# EAGLE schematic fc-comms (EAGLE 6.6.0)

## Sheet 1 of 2
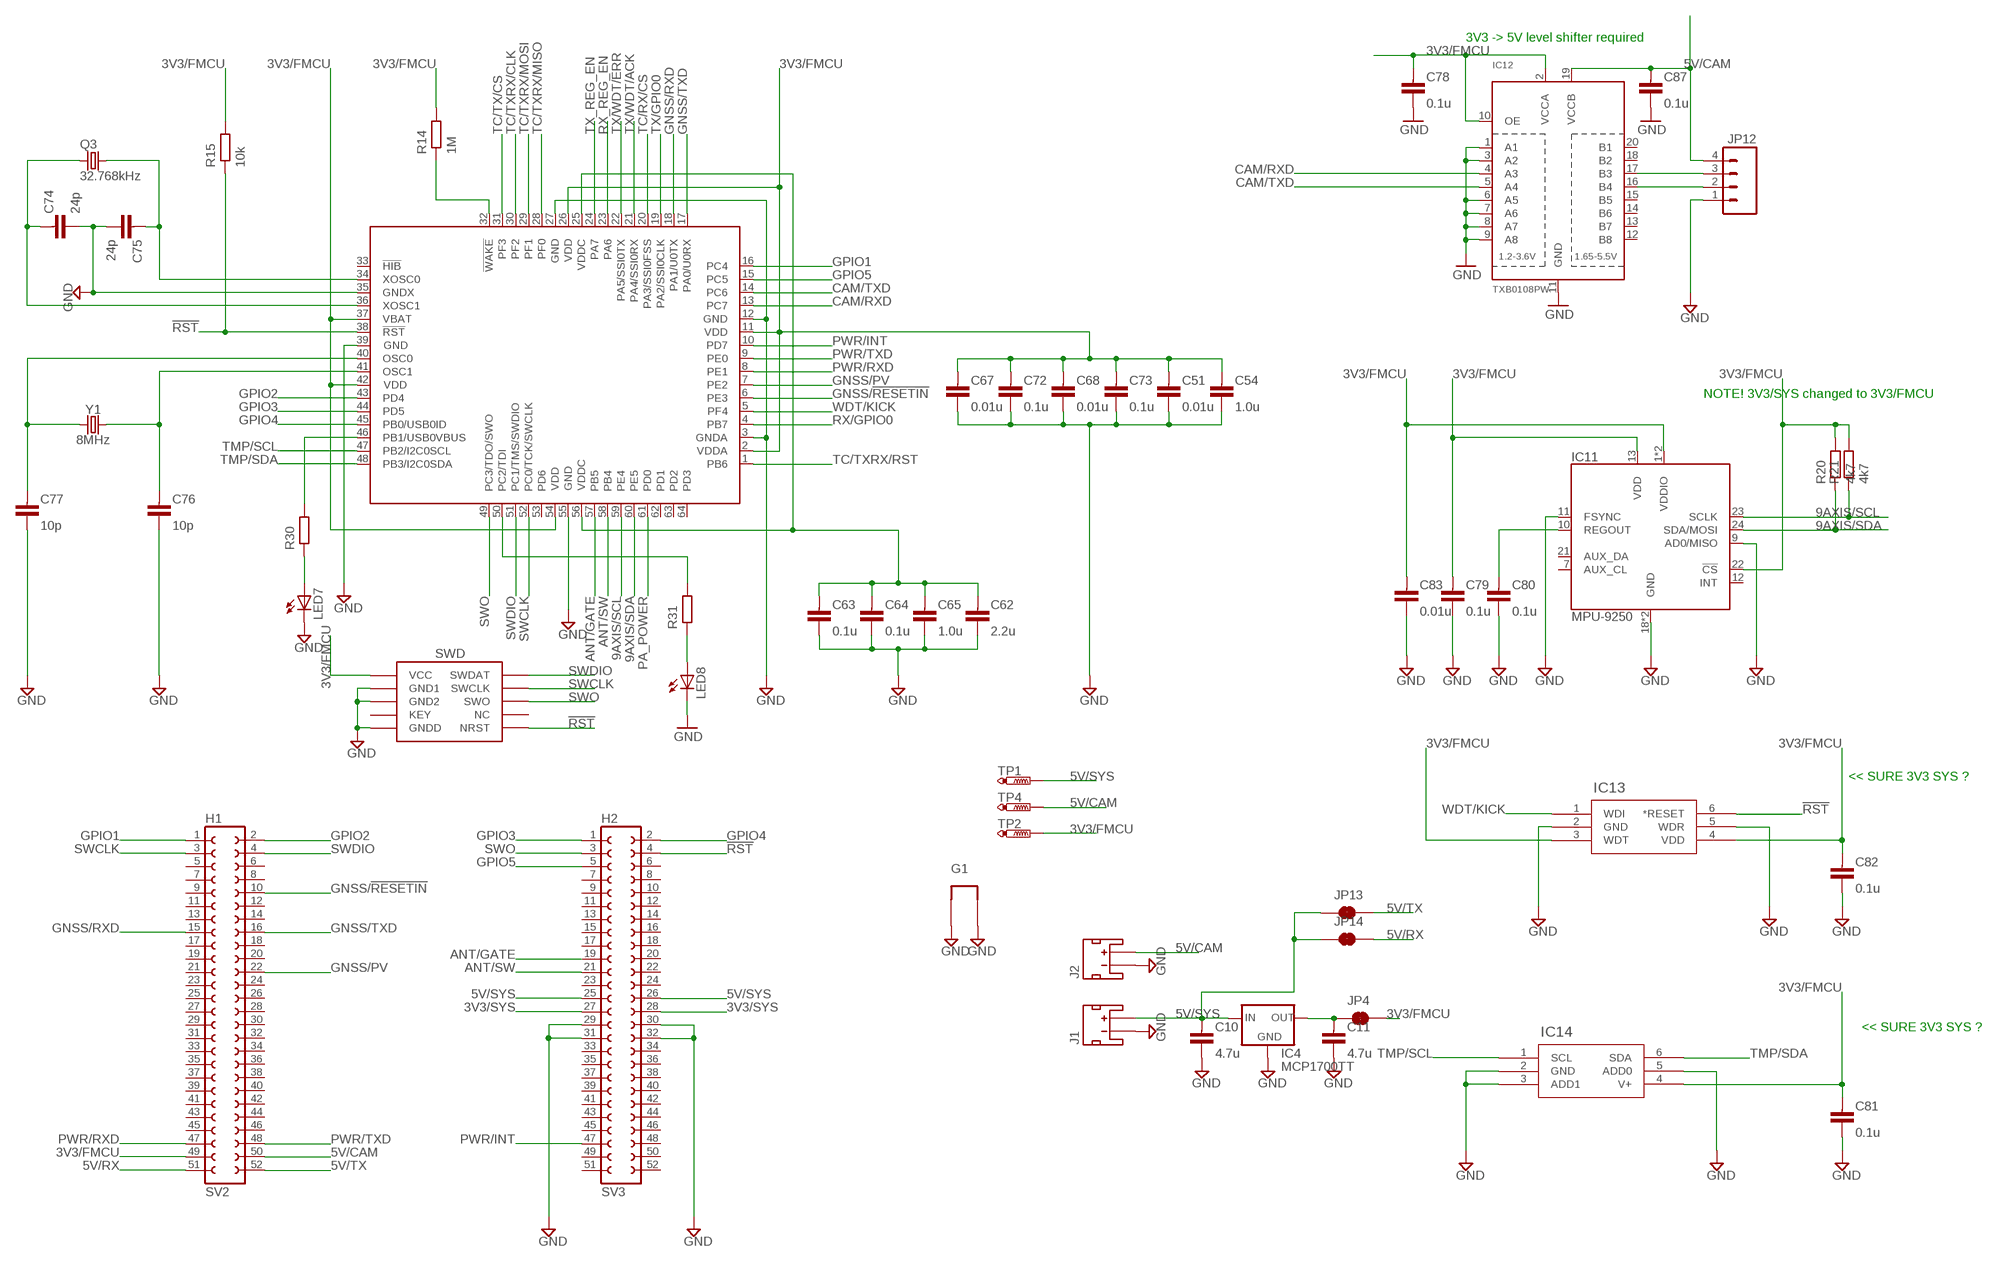
[diagram p0: schematic, sheet 1]

### Parts
C10  4.7u  CAPACITOR0603-N  [C0603-N]
C11  4.7u  CAPACITOR0603-N  [C0603-N]
C51  0.01u  CAPACITOR0603-N  [C0603-N]
C54  1.0u  CAPACITOR0603-N  [C0603-N]
C62  2.2u  CAPACITOR0603-N  [C0603-N]
C63  0.1u  CAPACITOR0603-N  [C0603-N]
C64  0.1u  CAPACITOR0603-N  [C0603-N]
C65  1.0u  CAPACITOR0603-N  [C0603-N]
C67  0.01u  CAPACITOR0603-N  [C0603-N]
C68  0.01u  CAPACITOR0603-N  [C0603-N]
C72  0.1u  CAPACITOR0603-N  [C0603-N]
C73  0.1u  CAPACITOR0603-N  [C0603-N]
C74  24p  CAPACITOR0603-N  [C0603-N]
C75  24p  CAPACITOR0603-N  [C0603-N]
C76  10p  CAPACITOR0603-N  [C0603-N]
C77  10p  CAPACITOR0603-N  [C0603-N]
C78  0.1u  CAPACITOR0603-N  [C0603-N]
C79  0.1u  CAPACITOR0603-N  [C0603-N]
C80  0.1u  CAPACITOR0603-N  [C0603-N]
C81  0.1u  CAPACITOR0603-N  [C0603-N]
C82  0.1u  CAPACITOR0603-N  [C0603-N]
C83  0.01u  CAPACITOR0603-N  [C0603-N]
C87  0.1u  CAPACITOR0603-N  [C0603-N]
G1  GND-LOOPL  [GND-LOOP-0.4]
IC4  MCP1700TT  [SOT23]
IC9  TM4C123[7,G]XXPM  [PM_S-PQFP-G64]
IC11  MPU-9250  [QFN-24/3MM]
IC12  TXB0108PW  [TSSOP20]
IC13  TPS3813K33-EP_DBV_6  [DBV6]
IC14  TMP100-EP_DBV_6  [DBV6]
J1  JST_2MM_MALE_TH  [JST-2-TH]
J2  JST_2MM_MALE_TH  [JST-2-TH]
J3  SWD_SHROUD  [SWD_PTH_SHROUD]
JP4  JUMPER-SMT_2_NC_TRACE_SILK  [SMT-JUMPER_2_NC_TRACE_SILK]
JP12  M04PTH  [1X04]
JP13  JUMPER-SMT_2_NC_TRACE_SILK  [SMT-JUMPER_2_NC_TRACE_SILK]
JP14  JUMPER-SMT_2_NC_TRACE_SILK  [SMT-JUMPER_2_NC_TRACE_SILK]
LED7  LEDCHIP-LED0603  [CHIP-LED0603]
LED8  LEDCHIP-LED0603  [CHIP-LED0603]
Q3  32.768kHz  RESONATOR_EPSON_FC_145  [RESONATOR_EPSON_FC_145]
R14  1M  RESISTOR0603-N  [R0603-N]
R15  10k  RESISTOR0603-N  [R0603-N]
R20  4k7  RESISTOR0603-N  [R0603-N]
R21  4k7  RESISTOR0603-N  [R0603-N]
R30  RESISTOR0603-N  [R0603-N]
R31  RESISTOR0603-N  [R0603-N]
SV2  H1  FE26-2  [FE26-2]
SV3  H2  FE26-2  [FE26-2]
TP1  PTR1PAD1-13  [P1-13]
TP2  PTR1PAD1-13  [P1-13]
TP4  PTR1PAD1-13  [P1-13]
Y1  8MHz  CRYSTAL-8MHZSMD-5X3.2  [CRYSTAL-SMD-5X3.2-4PAD]

### Nets
3V3/FMCU: C51.1 C54.1 C67.1 C68.1 C72.1 C73.1 C78.1 C79.1 C81.1 C82.1 C83.1 IC9.2(VDDA) IC9.11(VDD) IC9.26(VDD) IC9.37(VBAT) IC9.42(VDD) IC9.54(VDD) IC11.1(VDDIO) IC11.8(VDDIO) IC11.13(VDD) IC11.22(!CS) IC12.2(VCCA) IC12.10(OE) IC13.3(WDT) IC13.4(VDD) IC14.4(V+) J3.1(VCC) JP4.2 R14.2 R15.2 R20.2 R21.2 SV2.49 TP2.TP ; also sheet 2
3V3/SYS: SV3.27 SV3.28
5V/CAM: C87.1 IC12.19(VCCB) J2.1(+) JP12.4 SV2.50 TP4.TP
5V/RX: JP14.2 SV2.51 ; also sheet 2
5V/SYS: C10.1 IC4.3(IN) J1.1(+) JP13.1 JP14.1 SV3.25 SV3.26 TP1.TP
5V/TX: JP13.2 SV2.52 ; also sheet 2
9AXIS/SCL: IC9.59(PE4) IC11.23(SCLK) R21.1
9AXIS/SDA: IC9.60(PE5) IC11.24(SDA/MOSI) R20.1
!RST: IC9.38(!RST) IC13.6(*RESET) J3.10(NRST) R15.1 SV3.4
!WAKE: IC9.32(!WAKE) R14.1
ANT/GATE: IC9.57(PB5) SV3.19
ANT/SW: IC9.58(PB4) SV3.21
CAM/RXD: IC9.13(PC7) IC12.4(A3)
CAM/TXD: IC9.14(PC6) IC12.5(A4)
GND: C10.2 C11.2 C51.2 C54.2 C62.2 C63.2 C64.2 C65.2 C67.2 C68.2 C72.2 C73.2 C74.2 C75.2 C76.2 C77.2 C78.2 C79.2 C80.2 C81.2 C82.2 C83.2 C87.2 G1.P$3 G1.P$4 IC4.1(GND) IC9.3(GNDA) IC9.12(GND) IC9.27(GND) IC9.35(GNDX) IC9.39(GND) IC9.55(GND) IC11.9(AD0/MISO) IC11.11(FSYNC) IC11.18(GND) IC11.20(GND) IC12.1(A1) IC12.3(A2) IC12.6(A5) IC12.7(A6) IC12.8(A7) IC12.9(A8) IC12.11(GND) IC13.2(GND) IC13.5(WDR) IC14.2(GND) IC14.3(ADD1) IC14.5(ADD0) J1.2(-) J2.2(-) J3.3(GND1) J3.5(GND2) J3.9(GNDD) JP12.1 LED7.C LED8.C SV3.29 SV3.30 SV3.31 SV3.32 ; also sheet 2
GNSS/!RESETIN: IC9.6(PE3) SV2.10
GNSS/PV: IC9.7(PE2) SV2.22
GNSS/RXD: IC9.18(PA1/U0TX) SV2.15
GNSS/TXD: IC9.17(PA0/U0RX) SV2.16
GPIO1: IC9.16(PC4) SV2.1
GPIO2: IC9.43(PD4) SV2.2
GPIO3: IC9.44(PD5) SV3.1
GPIO4: IC9.45(PB0/USB0ID) SV3.2
GPIO5: IC9.15(PC5) SV3.5
N$4: C80.1 IC11.10(REGOUT)
N$5: C62.1 C63.1 C64.1 C65.1 IC9.25(VDDC) IC9.56(VDDC)
N$6: C75.1 IC9.34(XOSC0) Q3.P$2
N$8: C77.1 IC9.40(OSC0) Y1.1
N$33: C76.1 IC9.41(OSC1) Y1.3
N$34: C74.1 IC9.36(XOSC1) Q3.P$1
N$43: LED7.A R30.1
N$44: LED8.A R31.1
N$49: IC9.50(PC2/TDI) R31.2
N$51: IC9.46(PB1/USB0VBUS) R30.2
N$61: IC12.17(B3) JP12.3
N$64: C11.1 IC4.2(OUT) JP4.1
N$73: IC12.16(B4) JP12.2
PA_POWER: IC9.61(PD0) ; also sheet 2
PWR/INT: IC9.10(PD7) SV3.47
PWR/RXD: IC9.8(PE1) SV2.47
PWR/TXD: IC9.9(PE0) SV2.48
RX/GPIO0: IC9.4(PB7) ; also sheet 2
RX_REG_EN: IC9.23(PA6) ; also sheet 2
SWCLK: IC9.52(PC0/TCK/SWCLK) J3.4(SWCLK) SV2.3
SWDIO: IC9.51(PC1/TMS/SWDIO) J3.2(SWDAT) SV2.4
SWO: IC9.49(PC3/TDO/SWO) J3.6(SWO) SV3.3
TC/RX/CS: IC9.20(PA3/SSI0FSS) ; also sheet 2
TC/TX/CS: IC9.31(PF3) ; also sheet 2
TC/TXRX/CLK: IC9.30(PF2) ; also sheet 2
TC/TXRX/MISO: IC9.28(PF0) ; also sheet 2
TC/TXRX/MOSI: IC9.29(PF1) ; also sheet 2
TC/TXRX/RST: IC9.1(PB6) ; also sheet 2
TMP/SCL: IC9.47(PB2/I2C0SCL) IC14.1(SCL) ; also sheet 2
TMP/SDA: IC9.48(PB3/I2C0SDA) IC14.6(SDA) ; also sheet 2
TX/GPIO0: IC9.19(PA2/SSI0CLK) ; also sheet 2
TX/WDT/ACK: IC9.21(PA4/SSI0RX) ; also sheet 2
TX/WDT/ERR: IC9.22(PA5/SSI0TX) ; also sheet 2
TX_REG_EN: IC9.24(PA7) ; also sheet 2
WDT/KICK: IC9.5(PF4) IC13.1(WDI)
Unconnected: IC9.33(!HIB) IC9.53(PD6) IC9.62(PD1) IC9.63(PD2) IC9.64(PD3) IC11.7(AUX_CL) IC11.12(INT) IC11.21(AUX_DA) IC12.12(B8) IC12.13(B7) IC12.14(B6) IC12.15(B5) IC12.18(B2) IC12.20(B1) J3.7(KEY) J3.8(NC) SV2.5 SV2.6 SV2.7 SV2.8 SV2.9 SV2.11 SV2.12 SV2.13 SV2.14 SV2.17 SV2.18 SV2.19 SV2.20 SV2.21 SV2.23 SV2.24 SV2.25 SV2.26 SV2.27 SV2.28 SV2.29 SV2.30 SV2.31 SV2.32 SV2.33 SV2.34 SV2.35 SV2.36 SV2.37 SV2.38 SV2.39 SV2.40 SV2.41 SV2.42 SV2.43 SV2.44 SV2.45 SV2.46 SV3.6 SV3.7 SV3.8 SV3.9 SV3.10 SV3.11 SV3.12 SV3.13 SV3.14 SV3.15 SV3.16 SV3.17 SV3.18 SV3.20 SV3.22 SV3.23 SV3.24 SV3.33 SV3.34 SV3.35 SV3.36 SV3.37 SV3.38 SV3.39 SV3.40 SV3.41 SV3.42 SV3.43 SV3.44 SV3.45 SV3.46 SV3.48 SV3.49 SV3.50 SV3.51 SV3.52

### Notes on the sheet
- 3V3 -> 5V level shifter required
- NOTE! 3V3/SYS changed to 3V3/FMCU
- << SURE 3V3 SYS ?
- << SURE 3V3 SYS ?

## Sheet 2 of 2
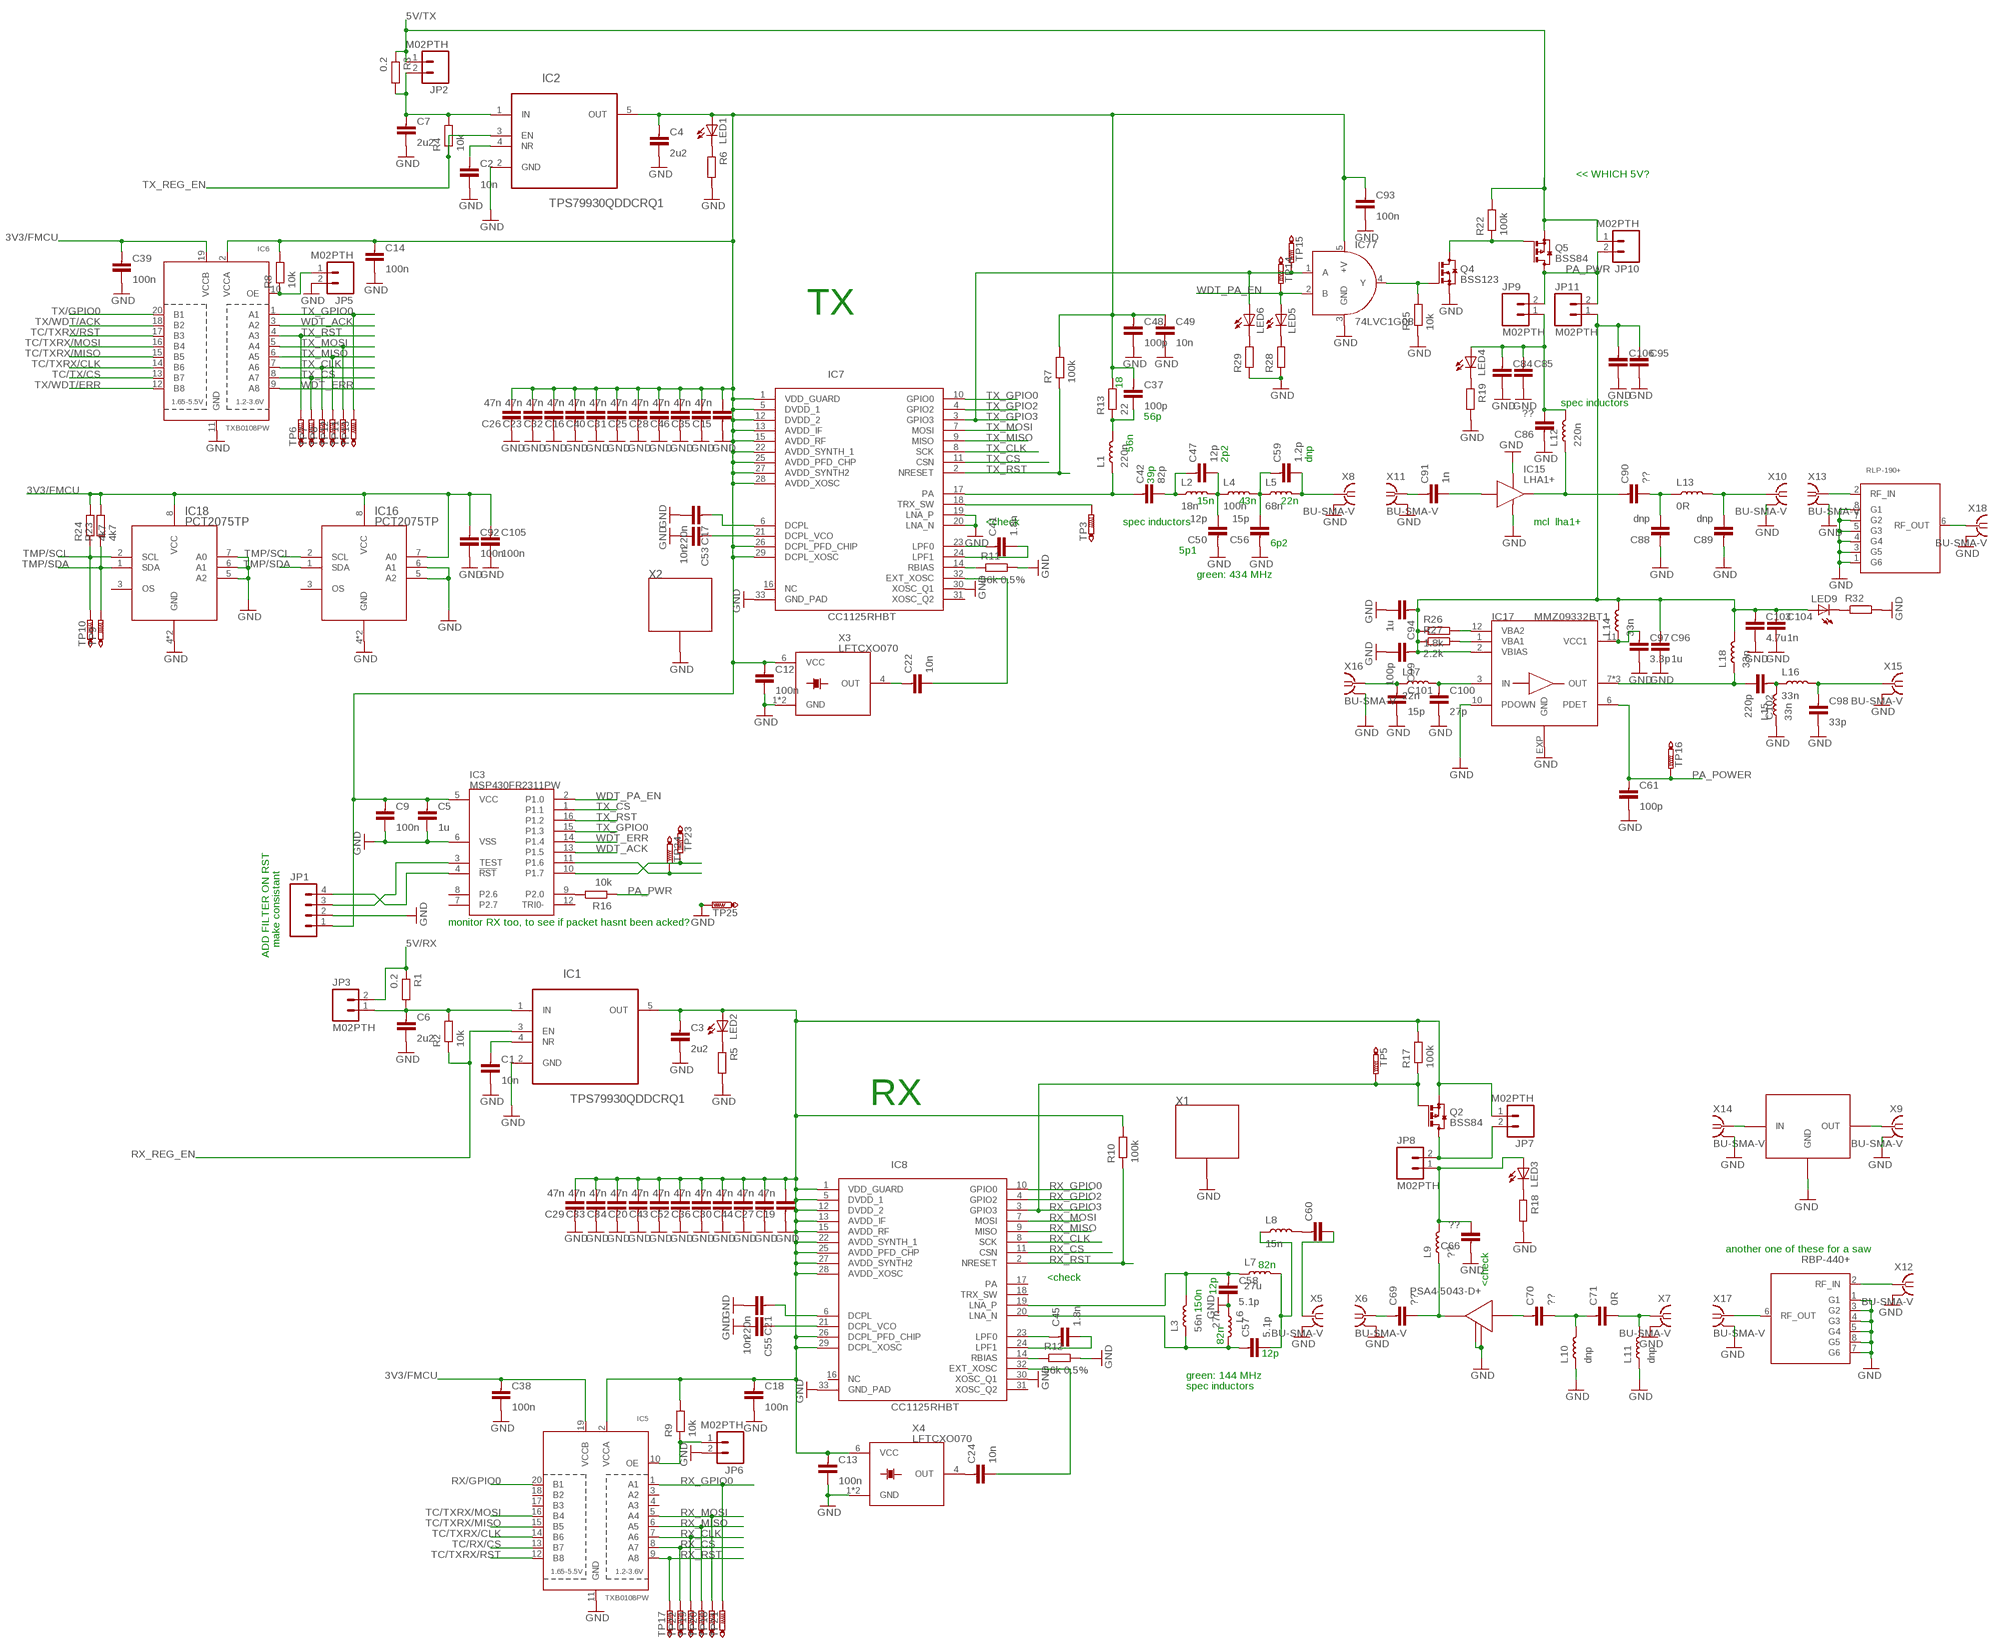
[diagram p1: schematic, sheet 2]

### Parts
C1  10n  CAPACITOR0603-N  [C0603-N]
C2  10n  CAPACITOR0603-N  [C0603-N]
C3  2u2  CAPACITOR0603-N  [C0603-N]
C4  2u2  CAPACITOR0603-N  [C0603-N]
C5  1u  CAPACITOR0603-N  [C0603-N]
C6  2u2  CAPACITOR0603-N  [C0603-N]
C7  2u2  CAPACITOR0603-N  [C0603-N]
C9  100n  CAPACITOR0603-N  [C0603-N]
C12  100n  CAPACITOR0603-N  [C0603-N]
C13  100n  CAPACITOR0603-N  [C0603-N]
C14  100n  CAPACITOR0603-N  [C0603-N]
C15  47n  CAPACITOR0603-N  [C0603-N]
C16  47n  CAPACITOR0603-N  [C0603-N]
C17  220n  CAPACITOR0603-N  [C0603-N]
C18  100n  CAPACITOR0603-N  [C0603-N]
C19  47n  CAPACITOR0603-N  [C0603-N]
C20  47n  CAPACITOR0603-N  [C0603-N]
C21  220n  CAPACITOR0603-N  [C0603-N]
C22  10n  CAPACITOR0603-N  [C0603-N]
C23  47n  CAPACITOR0603-N  [C0603-N]
C24  10n  CAPACITOR0603-N  [C0603-N]
C25  47n  CAPACITOR0603-N  [C0603-N]
C26  47n  CAPACITOR0603-N  [C0603-N]
C27  47n  CAPACITOR0603-N  [C0603-N]
C28  47n  CAPACITOR0603-N  [C0603-N]
C29  47n  CAPACITOR0603-N  [C0603-N]
C30  47n  CAPACITOR0603-N  [C0603-N]
C31  47n  CAPACITOR0603-N  [C0603-N]
C32  47n  CAPACITOR0603-N  [C0603-N]
C33  47n  CAPACITOR0603-N  [C0603-N]
C34  47n  CAPACITOR0603-N  [C0603-N]
C35  47n  CAPACITOR0603-N  [C0603-N]
C36  47n  CAPACITOR0603-N  [C0603-N]
C37  100p  CAPACITOR0603-N  [C0603-N]
C38  100n  CAPACITOR0603-N  [C0603-N]
C39  100n  CAPACITOR0603-N  [C0603-N]
C40  47n  CAPACITOR0603-N  [C0603-N]
C41  1.8n  CAPACITOR0603-N  [C0603-N]
C42  82p  CAPACITOR0603-N  [C0603-N]
C43  47n  CAPACITOR0603-N  [C0603-N]
C44  47n  CAPACITOR0603-N  [C0603-N]
C45  1.8n  CAPACITOR0603-N  [C0603-N]
C46  47n  CAPACITOR0603-N  [C0603-N]
C47  12p  CAPACITOR0603-N  [C0603-N]
C48  100p  CAPACITOR0603-N  [C0603-N]
C49  10n  CAPACITOR0603-N  [C0603-N]
C50  12p  CAPACITOR0603-N  [C0603-N]
C52  47n  CAPACITOR0603-N  [C0603-N]
C53  10n  CAPACITOR0603-N  [C0603-N]
C55  10n  CAPACITOR0603-N  [C0603-N]
C56  15p  CAPACITOR0603-N  [C0603-N]
C57  5.1p  CAPACITOR0603-N  [C0603-N]
C58  5.1p  CAPACITOR0603-N  [C0603-N]
C59  1.2p  CAPACITOR0603-N  [C0603-N]
C60  CAPACITOR0603-N  [C0603-N]
C61  100p  CAPACITOR0603-N  [C0603-N]
C66  ??  CAPACITOR0603-N  [C0603-N]
C69  ??  CAPACITOR0603-N  [C0603-N]
C70  ??  CAPACITOR0603-N  [C0603-N]
C71  0R  CAPACITOR0603-N  [C0603-N]
C84  CAPACITOR0805-N  [C0805-N]
C85  CAPACITOR0805-N  [C0805-N]
C86  ??  CAPACITOR0603-N  [C0603-N]
C88  dnp  CAPACITOR0603-N  [C0603-N]
C89  dnp  CAPACITOR0603-N  [C0603-N]
C90  ??  CAPACITOR0603-N  [C0603-N]
C91  1n  CAPACITOR0603-N  [C0603-N]
C92  100n  CAPACITOR0603-N  [C0603-N]
C93  100n  CAPACITOR0603-N  [C0603-N]
C94  1u  CAPACITOR0603-N  [C0603-N]
C95  CAPACITOR0805-N  [C0805-N]
C96  1u  CAPACITOR0603-N  [C0603-N]
C97  3.3p  CAPACITOR0603-N  [C0603-N]
C98  33p  CAPACITOR0603-N  [C0603-N]
C99  100p  CAPACITOR0603-N  [C0603-N]
C100  27p  CAPACITOR0603-N  [C0603-N]
C101  15p  CAPACITOR0603-N  [C0603-N]
C102  220p  CAPACITOR0603-N  [C0603-N]
C103  4.7u  CAPACITOR0603-N  [C0603-N]
C104  1n  CAPACITOR0603-N  [C0603-N]
C105  100n  CAPACITOR0603-N  [C0603-N]
C106  CAPACITOR0805-N  [C0805-N]
FL1  GOLLEDGE_SAW_FILTER  [GOLLEDGE_SAW]
FL2  SAW_FILTER_CS  [PL-176]
FL3  LPF_CS  [PL-176]
IC1  TPS79930QDDCRQ1  TPS79933QDDCRQ1  [SOT95P280X110-5N]
IC2  TPS79930QDDCRQ1  TPS79933QDDCRQ1  [SOT95P280X110-5N]
IC3  MSP430FR2311PW  [SSOP16]
IC5  TXB0108PW  [TSSOP20]
IC6  TXB0108PW  [TSSOP20]
IC7  CC1125RHBT  [QFN32_5X5]
IC8  CC1125RHBT  [QFN32_5X5]
IC10  LNA_COMMON  [LNA_MMM1362]
IC15  LHA1+  PA  [PA]
IC16  PCT2075TP  [HWSON8]
IC17  MMZ09332BT1  [QFN3X3-6]
IC18  PCT2075TP  [HWSON8]
IC77  74LVC1G08  SN74LVC1G08  [SOT23-5]
JP1  M04PTH  [1X04]
JP2  M02PTH  [1X02]
JP3  M02PTH  [1X02]
JP5  M02PTH  [1X02]
JP6  M02PTH  [1X02]
JP7  M02PTH  [1X02]
JP8  M02PTH  [1X02]
JP9  M02PTH  [1X02]
JP10  M02PTH  [1X02]
JP11  M02PTH  [1X02]
L1  220n  INDUCTOR0603-N  [L0603-N]
L2  18n  INDUCTOR0603-N  [L0603-N]
L3  56n  INDUCTOR0603-N  [L0603-N]
L4  100n  INDUCTOR0603-N  [L0603-N]
L5  68n  INDUCTOR0603-N  [L0603-N]
L6  27n  INDUCTOR0603-N  [L0603-N]
L7  27u  INDUCTOR0603-N  [L0603-N]
L8  15n  INDUCTOR0603-N  [L0603-N]
L9  ??  INDUCTOR0603-N  [L0603-N]
L10  dnp  INDUCTOR0603-N  [L0603-N]
L11  dnp  INDUCTOR0603-N  [L0603-N]
L12  220n  INDUCTOR0603-N  [L0603-N]
L13  0R  INDUCTOR0603-N  [L0603-N]
L14  33n  INDUCTOR0603-N  [L0603-N]
L15  33n  INDUCTOR0603-N  [L0603-N]
L16  33n  INDUCTOR0603-N  [L0603-N]
L17  22n  INDUCTOR0603-N  [L0603-N]
L18  33n  INDUCTOR0603-N  [L0603-N]
LED1  LEDCHIP-LED0603  [CHIP-LED0603]
LED2  LEDCHIP-LED0603  [CHIP-LED0603]
LED3  LEDCHIP-LED0603  [CHIP-LED0603]
LED4  LEDCHIP-LED0603  [CHIP-LED0603]
LED5  LEDCHIP-LED0603  [CHIP-LED0603]
LED6  LEDCHIP-LED0603  [CHIP-LED0603]
LED9  LEDCHIP-LED0603  [CHIP-LED0603]
Q2  BSS84  [SOT23]
Q4  BSS123  [SOT23]
Q5  BSS84  [SOT23]
R1  0.2  RESISTOR0603-N  [R0603-N]
R2  10k  RESISTOR0603-N  [R0603-N]
R3  0.2  RESISTOR0603-N  [R0603-N]
R4  10k  RESISTOR0603-N  [R0603-N]
R5  RESISTOR0603-N  [R0603-N]
R6  RESISTOR0603-N  [R0603-N]
R7  100k  RESISTOR0603-N  [R0603-N]
R8  10k  RESISTOR0603-N  [R0603-N]
R9  10k  RESISTOR0603-N  [R0603-N]
R10  100k  RESISTOR0603-N  [R0603-N]
R11  56k 0.5%  RESISTOR0603-N  [R0603-N]
R12  56k 0.5%  RESISTOR0603-N  [R0603-N]
R13  22  RESISTOR0603-N  [R0603-N]
R16  10k  RESISTOR0603-N  [R0603-N]
R17  100k  RESISTOR0603-N  [R0603-N]
R18  RESISTOR0603-N  [R0603-N]
R19  RESISTOR0603-N  [R0603-N]
R22  100k  RESISTOR0603-N  [R0603-N]
R23  4k7  RESISTOR0603-N  [R0603-N]
R24  4k7  RESISTOR0603-N  [R0603-N]
R25  10k  RESISTOR0603-N  [R0603-N]
R26  1.8k  RESISTOR0603-N  [R0603-N]
R27  2.2k  RESISTOR0603-N  [R0603-N]
R28  RESISTOR0603-N  [R0603-N]
R29  RESISTOR0603-N  [R0603-N]
R32  RESISTOR0603-N  [R0603-N]
TP3  PTR1B1,27  [B1,27]
TP5  PTR1B1,27  [B1,27]
TP6  PTR1B1,27  [B1,27]
TP7  PTR1B1,27  [B1,27]
TP8  PTR1B1,27  [B1,27]
TP9  PTR1B1,27  [B1,27]
TP10  PTR1B1,27  [B1,27]
TP11  PTR1B1,27  [B1,27]
TP12  PTR1B1,27  [B1,27]
TP13  PTR1B1,27  [B1,27]
TP14  PTR1B1,27  [B1,27]
TP15  PTR1B1,27  [B1,27]
TP16  PTR1B1,27  [B1,27]
TP17  PTR1B1,27  [B1,27]
TP18  PTR1B1,27  [B1,27]
TP19  PTR1B1,27  [B1,27]
TP20  PTR1B1,27  [B1,27]
TP21  PTR1B1,27  [B1,27]
TP22  PTR1B1,27  [B1,27]
TP23  PTR1B1,27  [B1,27]
TP24  PTR1B1,27  [B1,27]
TP25  PTR1B1,27  [B1,27]
X1  SHIELD-26X26  [SHIELD-26X26]
X2  SHIELD-26X26  [SHIELD-26X26]
X3  LFTCXO070  [260-SERIES]
X4  LFTCXO070  [260-SERIES]
X5  BU-SMA-V  [BU-SMA-V]
X6  BU-SMA-V  [BU-SMA-V]
X7  BU-SMA-V  [BU-SMA-V]
X8  BU-SMA-V  [BU-SMA-V]
X9  BU-SMA-V  [BU-SMA-V]
X10  BU-SMA-V  [BU-SMA-V]
X11  BU-SMA-V  [BU-SMA-V]
X12  BU-SMA-V  [BU-SMA-V]
X13  BU-SMA-V  [BU-SMA-V]
X14  BU-SMA-V  [BU-SMA-V]
X15  BU-SMA-V  [BU-SMA-V]
X16  BU-SMA-V  [BU-SMA-V]
X17  BU-SMA-V  [BU-SMA-V]
X18  BU-SMA-V  [BU-SMA-V]

### Nets
3V3/FMCU: C38.1 C39.1 C92.1 C105.1 IC5.19(VCCB) IC6.19(VCCB) IC16.7(A0) IC16.8(VCC) IC18.8(VCC) R23.2 R24.2 ; also sheet 1
5V/RX: JP3.2 R1.1 ; also sheet 1
5V/TX: JP2.1 JP10.1 Q5.2(S) R3.1 R22.2 ; also sheet 1
EWFEWF: C6.1 IC1.1(IN) JP3.1 R1.2 R2.2
GND: C1.2 C2.2 C3.2 C4.2 C5.2 C6.2 C7.2 C9.2 C12.2 C13.2 C14.2 C15.1 C16.1 C17.2 C18.2 C19.1 C20.1 C21.2 C23.1 C25.1 C26.1 C27.1 C28.1 C29.1 C30.1 C31.1 C32.1 C33.1 C34.1 C35.1 C36.1 C38.2 C39.2 C40.1 C43.1 C44.1 C46.1 C48.2 C49.2 C50.1 C52.1 C53.2 C55.2 C56.1 C58.2 C61.2 C66.1 C84.2 C85.2 C86.1 C88.1 C89.1 C92.2 C93.2 C94.2 C95.2 C96.2 C97.2 C98.2 C99.2 C100.2 C101.2 C103.2 C104.2 C105.2 C106.2 FL1.A(GND) FL1.C(GND) FL1.D(GND) FL1.F(GND) FL2.1(G1) FL2.3(G2) FL2.4(G3) FL2.5(G4) FL2.7(G6) FL2.8(G5) FL3.1(G6) FL3.3(G5) FL3.4(G4) FL3.5(G3) FL3.7(G2) FL3.8(G1) IC1.2(GND) IC2.2(GND) IC3.6(VSS) IC5.11(GND) IC6.11(GND) IC7.19(LNA_P) IC7.20(LNA_N) IC7.30(XOSC_Q1) IC7.33(GND_PAD) IC8.30(XOSC_Q1) IC8.33(GND_PAD) IC10.2 IC10.4 IC15.GND1 IC15.GND2 IC16.4(GND) IC16.5(A2) IC16.6(A1) IC16.EP(GND) IC17.10(PDOWN) IC17.EXP(GND) IC18.4(GND) IC18.5(A2) IC18.6(A1) IC18.7(A0) IC18.EP(GND) IC77.3(GND) JP1.2 JP5.2 JP6.2 L6.1 L10.1 L11.1 L15.1 Q4.2(S) R5.2 R6.2 R11.2 R12.2 R18.2 R19.2 R25.1 R28.1 R29.1 R32.2 TP25.TP X1.G1(G) X1.G2(G) X1.G3(G) X1.G4(G) X1.G5(G) X1.G6(G) X1.G7(G) X1.G8(G) X1.G9(G) X1.G10(G) X1.G11(G) X1.G12(G) X1.G13(G) X1.G14(G) X1.G15(G) X1.G16(G) X1.G17(G) X1.G19(G) X1.G20(G) X1.G21(G) X2.G1(G) X2.G2(G) X2.G3(G) X2.G4(G) X2.G5(G) X2.G6(G) X2.G7(G) X2.G8(G) X2.G9(G) X2.G10(G) X2.G11(G) X2.G12(G) X2.G13(G) X2.G14(G) X2.G15(G) X2.G16(G) X2.G17(G) X2.G19(G) X2.G20(G) X2.G21(G) X3.1(GND) X3.3(GND) X4.1(GND) X4.3(GND) X5.2 X5.3 X5.4 X5.5 X6.2 X6.3 X6.4 X6.5 X7.2 X7.3 X7.4 X7.5 X8.2 X8.3 X8.4 X8.5 X9.2 X9.3 X9.4 X9.5 X10.2 X10.3 X10.4 X10.5 X11.2 X11.3 X11.4 X11.5 X12.2 X12.3 X12.4 X12.5 X13.2 X13.3 X13.4 X13.5 X14.2 X14.3 X14.4 X14.5 X15.2 X15.3 X15.4 X15.5 X16.2 X16.3 X16.4 X16.5 X17.2 X17.3 X17.4 X17.5 X18.2 X18.3 X18.4 X18.5 ; also sheet 1
N$1: IC3.9(P2.0) R16.2
N$2: C66.2 JP8.1 L9.2 LED3.A
N$7: C41.1 IC7.23(LPF0)
N$9: C41.2 IC7.24(LPF1)
N$11: C53.1 IC7.21(DCPL_VCO)
N$12: C42.1 IC7.17(PA) L1.1
N$13: IC7.14(RBIAS) R11.1
N$14: C22.2 IC7.32(EXT_XOSC)
N$15: C37.2 L1.2 R13.1
N$16: C91.2 IC15.RF_IN
N$17: C69.1 X6.1
N$18: C90.1 IC15.RF_OUT L12.1
N$19: C17.1 IC7.6(DCPL)
N$20: C42.2 C47.1 L2.1
N$21: C47.2 C50.2 L2.2 L4.1
N$22: C56.2 C59.1 L4.2 L5.1
N$23: C59.2 L5.2 X8.1
N$24: C94.1 C95.1 C96.1 C99.1 C103.1 C104.1 C106.1 IC17.2(VBIAS) JP11.1 L14.2 L18.2 LED9.A R26.1 R27.1
N$25: C69.2 IC10.1(RF_OUT) L9.1
N$26: C91.1 X11.1
N$27: C88.2 C90.2 L13.1
N$28: FL3.2(RF_IN) X13.1
N$29: FL3.6(RF_OUT) X18.1
N$30: C45.1 IC8.23(LPF0)
N$31: C45.2 IC8.24(LPF1)
N$32: C55.1 IC8.21(DCPL_VCO)
N$35: IC8.14(RBIAS) R12.1
N$36: C24.2 IC8.32(EXT_XOSC)
N$37: C89.2 L13.2 X10.1
N$38: LED5.C R28.2
N$39: IC7.18(TRX_SW) TP3.TP
N$40: C4.1 C5.1 C9.1 C12.1 C14.1 C15.2 C16.2 C23.2 C25.2 C26.2 C28.2 C31.2 C32.2 C35.2 C37.1 C40.2 C46.2 C48.1 C49.1 C93.1 IC2.5(OUT) IC3.5(VCC) IC6.2(VCCA) IC7.1(VDD_GUARD) IC7.5(DVDD_1) IC7.12(DVDD_2) IC7.13(AVDD_IF) IC7.15(AVDD_RF) IC7.22(AVDD_SYNTH_1) IC7.25(AVDD_PFD_CHP) IC7.26(DCPL_PFD_CHIP) IC7.27(AVDD_SYNTH2) IC7.28(AVDD_XOSC) IC7.29(DCPL_XOSC) IC77.5(+V) JP1.1 LED1.A R7.2 R8.2 R13.2 X3.6(VCC)
N$41: LED6.C R29.2
N$45: C21.1 IC8.6(DCPL)
N$46: C70.1 IC10.3(RF_IN)
N$47: C58.1 IC8.19(LNA_P) L3.2 L7.1
N$48: C57.1 IC8.20(LNA_N) L3.1 L6.2
N$50: C70.2 C71.1 L10.2
N$52: JP7.2 JP8.2 Q2.3(D)
N$53: C3.1 C13.1 C18.1 C19.2 C20.2 C27.2 C29.2 C30.2 C33.2 C34.2 C36.2 C43.2 C44.2 C52.2 IC1.5(OUT) IC5.2(VCCA) IC8.1(VDD_GUARD) IC8.5(DVDD_1) IC8.12(DVDD_2) IC8.13(AVDD_IF) IC8.15(AVDD_RF) IC8.22(AVDD_SYNTH_1) IC8.25(AVDD_PFD_CHP) IC8.26(DCPL_PFD_CHIP) IC8.27(AVDD_SYNTH2) IC8.28(AVDD_XOSC) IC8.29(DCPL_XOSC) JP7.1 LED2.A Q2.2(S) R9.2 R10.2 R17.2 X4.6(VCC)
N$54: C71.2 L11.2 X7.1
N$55: FL2.2(RF_IN) X12.1
N$56: FL2.6(RF_OUT) X17.1
N$57: C2.1 IC2.4(NR)
N$60: C1.1 IC1.4(NR)
N$62: Q4.3(D) Q5.1(G) R22.1
N$66: LED1.C R6.1
N$67: LED2.C R5.1
N$68: FL1.E(OUT) X9.1
N$69: FL1.B(IN) X14.1
N$70: C102.1 L15.2 L16.1
N$71: C102.2 IC17.7(OUT) IC17.8(OUT) IC17.9(OUT) L18.1
N$72: C98.1 L16.2 X15.1
N$74: C97.1 IC17.11(VCC1) L14.1
N$75: IC17.12(VBA2) R26.2
N$76: IC17.1(VBA1) R27.2
N$77: C101.1 L17.1 X16.1
N$78: C100.1 IC17.3(IN) L17.2
N$83: C84.1 C85.1 C86.2 JP9.1 L12.2 LED4.A
N$84: LED4.C R19.1
N$85: LED9.C R32.1
N$86: LED3.C R18.1
N$87: C22.1 X3.4(OUT)
N$89: C24.1 X4.4(OUT)
N$90: IC3.3(TEST) JP1.3
N$91: IC3.4(!RST) JP1.4
N$92: IC3.11(P1.6) TP24.TP
N$93: IC3.10(P1.7) TP23.TP
N$94: C60.1 L8.2
N$95: C57.2 L7.2 L8.1
N$98: IC6.10(OE) JP5.1 R8.1
N$99: IC5.10(OE) JP6.1 R9.1
N$101: C60.2 X5.1
N$102: C7.1 IC2.1(IN) JP2.2 R3.2 R4.2
N$117: IC77.4(Y) Q4.1(G) R25.2
PA_POWER: C61.1 IC17.6(PDET) TP16.TP ; also sheet 1
PA_PWR: JP9.2 JP10.2 JP11.2 Q5.3(D) R16.1
RX/GPIO0: IC5.20(B1) ; also sheet 1
RX_CLK: IC5.7(A6) IC8.8(SCK) TP19.TP
RX_CS: IC5.8(A7) IC8.11(CSN) TP22.TP
RX_GPIO0: IC5.1(A1) IC8.10(GPIO0) TP21.TP
RX_GPIO2: IC8.4(GPIO2)
RX_GPIO3: IC8.3(GPIO3) Q2.1(G) R17.1 TP5.TP
RX_MISO: IC5.6(A5) IC8.9(MISO) TP20.TP
RX_MOSI: IC5.5(A4) IC8.7(MOSI) TP18.TP
RX_REG_EN: IC1.3(EN) R2.1 ; also sheet 1
RX_RST: IC5.9(A8) IC8.2(NRESET) R10.1 TP17.TP
TC/RX/CS: IC5.13(B7) ; also sheet 1
TC/TX/CS: IC6.13(B7) ; also sheet 1
TC/TXRX/CLK: IC5.14(B6) IC6.14(B6) ; also sheet 1
TC/TXRX/MISO: IC5.15(B5) IC6.15(B5) ; also sheet 1
TC/TXRX/MOSI: IC5.16(B4) IC6.16(B4) ; also sheet 1
TC/TXRX/RST: IC5.12(B8) IC6.17(B3) ; also sheet 1
TMP/SCL: IC16.2(SCL) IC18.2(SCL) R24.1 TP10.TP ; also sheet 1
TMP/SDA: IC16.1(SDA) IC18.1(SDA) R23.1 TP9.TP ; also sheet 1
TX/GPIO0: IC6.20(B1) ; also sheet 1
TX/WDT/ACK: IC6.18(B2) ; also sheet 1
TX/WDT/ERR: IC6.12(B8) ; also sheet 1
TX_CLK: IC6.7(A6) IC7.8(SCK) TP8.TP
TX_CS: IC3.1(P1.1) IC6.8(A7) IC7.11(CSN) TP7.TP
TX_GPIO0: IC3.15(P1.3) IC6.1(A1) IC7.10(GPIO0) TP13.TP
TX_GPIO2: IC7.4(GPIO2)
TX_GPIO3: IC7.3(GPIO3) IC77.1(A) LED6.A TP15.TP
TX_MISO: IC6.6(A5) IC7.9(MISO) TP12.TP
TX_MOSI: IC6.5(A4) IC7.7(MOSI) TP11.TP
TX_REG_EN: IC2.3(EN) R4.1 ; also sheet 1
TX_RST: IC3.16(P1.2) IC6.4(A3) IC7.2(NRESET) R7.1 TP6.TP
WDT_ACK: IC3.13(P1.5) IC6.3(A2)
WDT_ERR: IC3.14(P1.4) IC6.9(A8)
WDT_PA_EN: IC3.2(P1.0) IC77.2(B) LED5.A TP14.TP
Unconnected: IC3.7(P2.7) IC3.8(P2.6) IC3.12(TRI0-) IC5.3(A2) IC5.4(A3) IC5.17(B3) IC5.18(B2) IC7.16(NC) IC7.31(XOSC_Q2) IC8.16(NC) IC8.17(PA) IC8.18(TRX_SW) IC8.31(XOSC_Q2) IC16.3(OS) IC18.3(OS)

### Notes on the sheet
- << WHICH 5V?
- TX
- 18
- spec inductors
- 56p
- 56n
- 2p2 | dnp
- 39p
- 15n | 43n | 22n
- <check | spec inductors | mcl  lha1+
- 5p1 | 6p2
- green: 434 MHz
- monitor RX too, to see if packet hasnt been acked?
- make consistant
- ADD FILTER ON RST
- RX
- <check | another one of these for a saw
- 82n
- <check
- 12p
- 150n
- 82n
- 12p
- green: 144 MHz
- spec inductors

## Library data of the parts
C1-C7 C9-C106 = passives-7351:CAPACITOR
FL1 = Ava:GOLLEDGE_SAW_FILTER
FL2 = CubeSat3:SAW_FILTER_CS
FL3 = CubeSat3:LPF_CS
G1 = dtb:GND-LOOP
IC1 IC2 = cube-parts:TPS79933QDDCRQ1: LINEAR REGULATOR; MPN: TPS79933QDDCRQ1; OC_FARNELL: -; OC_NEWARK: 25R0151; PACKAGE: SOT-5; SUPPLIER: Texas Instruments
IC3 = CubeSat3:MSP430FR2311
IC4 = dtb:MCP1700
IC5 IC6 IC12 = cube-parts:TXB0108
IC7 IC8 = cube-parts:CC1125RHBT; FARNELL_OC: 2422924
IC9 = ti-tiva:TM4C123[7,G]XX
IC10 = CubeSat3:LNA_COMMON
IC11 = MPU-9250:MPU-9250: GYRO/ACCEL/COMPASS/9-AXIS; DIGIKEY: 1428-1019-1-ND
IC13 = TPS3813K33-EP_DBV_6:TPS3813K33-EP_DBV_6; DATASHEETURL: http://www.ti.com/lit/gpn/TPS3813K33-EP; DESCRIPTION: Enhanced Product Processor Supervisory Circuits With Window-Watchdog; FAMILY_NAME: SUPERVISOR AND RESET IC; GENERIC_PART_NUMBER: TPS3813K33-EP; INDUSTRY_STD_PKG_TYPE: SOT-23; MANUFACTURER: Texas Instruments; MANUFACTURER_PART_NUMBER: tps3813k33-ep_dbv_6; PACKAGE_DESIGNATOR: DBV; PIN_COUNT: 6; VENDOR: Texas Instruments
IC14 = TMP100-EP_DBV_6:TMP100-EP_DBV_6; DATASHEETURL: http://www.ti.com/lit/gpn/TMP100-EP; DESCRIPTION: Enhanced Product Digital Temperature Sensor With I2C Interface; FAMILY_NAME: TEMPERATURE SENSOR; GENERIC_PART_NUMBER: TMP100-EP; INDUSTRY_STD_PKG_TYPE: SOT-23; MANUFACTURER: Texas Instruments; MANUFACTURER_PART_NUMBER: tmp100-ep_dbv_6; PACKAGE_DESIGNATOR: DBV; PIN_COUNT: 6; VENDOR: Texas Instruments
IC15 = CubeSat3:PA
IC16 IC18 = CubeSat3:PCT2075; FARNELL: 2396745
IC17 = CubeSat3:MMZ09332BT1
IC77 = SparkFun-DigitalIC:SN74LVC1G08: Single-gate AND logic; PROD_ID: 10841
J1 J2 = dtb:JST_2MM_MALE_TH: Mates to single-cell LiPo batteries. CONN-08352
J3 = dtb:SWD_SHROUD
JP1 JP12 = SparkFun-Connectors:M04: Header 4 Standard 4-pin 0.1" header. Use with straight break away headers (SKU : PRT-00116), right angle break away headers (PRT-00553), swiss pins (PRT-00743), machine pins (PRT-00117), and female headers (PRT-00115). Molex polarized connector foot print use with SKU : PRT-08231 with associated crimp pins and housings. 1MM SMD Version SKU: PRT-10208
JP2 JP3 JP5-JP11 = SparkFun-Connectors:M02: Standard 2-pin 0.1" header. Use with - straight break away headers ( PRT-00116) - right angle break away headers (PRT-00553) - swiss pins (PRT-00743) - machine pins (PRT-00117) - female headers (PRT-00115) Molex polarized connector foot print use with: PRT-08233 with associated crimp pins and housings. 2.54_SCREWTERM for use with PRT-10571. 3.5mm Screw Terminal footprints for PRT-08084 5mm Screw Terminal footprints for use with PRT-08432
JP4 JP13 JP14 = SparkFun-Jumpers:JUMPER-SMT_2_NC_TRACE: Normally closed trace jumper This jumper has a trace between two pads so it's normally closed (NC). Use a razor knife to open the connection. For best results follow the IPC guidelines for cutting traces: Cutout at least 0.063 mm (0.005 in). Remove all loose material to clean up the cut area. Seal the cut with an approved epoxy. Reapply solder to reclose the connection.
L1-L18 = passives-7351:INDUCTOR
LED1-LED9 = dtb:LED: LED OSRAM: - CHIPLED LG R971, LG N971, LY N971, LG Q971, LY Q971, LO R971, LY R971 LH N974, LH R974 LS Q976, LO Q976, LY Q976 LO Q996 - Hyper CHIPLED LW Q18S LB Q993, LB Q99A, LB R99A - SideLED LS A670, LO A670, LY A670, LG A670, LP A670 LB A673, LV A673, LT A673, LW A673 LH A674 LY A675 LS A676, LA A676, LO A676, LY A676, LW A676 LS A679, LY A679, LG A679 - Hyper Micro SIDELED® LS Y876, LA Y876, LO Y876, LY Y876 LT Y87S - SmartLED LW L88C, LW L88S LB L89C, LB L89S, LG L890 LS L89K, LO L89K, LY L89K LS L896, LA L896, LO L896, LY L896 - TOPLED LS T670, LO T670, LY T670, LG T670, LP T670 LSG T670, LSP T670, LSY T670, LOP T670, LYG T670 LG T671, LOG T671, LSG T671 LB T673, LV T673, LT T673, LW T673 LH T674 LS T676, LA T676, LO T676, LY T676, LB T676, LH T676, LSB T676, LW T676 LB T67C, LV T67C, LT T67C, LS T67K, LO T67K, LY T67K, LW E67C LS E67B, LA E67B, LO E67B, LY E67B, LB E67C, LV E67C, LT E67C LW T67C LS T679, LY T679, LG T679 LS T770, LO T770, LY T770, LG T770, LP T770 LB T773, LV T773, LT T773, LW T773 LH T774 LS E675, LA E675, LY E675, LS T675 LS T776, LA T776, LO T776, LY T776, LB T776 LHGB T686 LT T68C, LB T68C - Hyper Mini TOPLED® LB M676 - Mini TOPLED Santana® LG M470 LS M47K, LO M47K, LY M47K Source: http://www.osram.convergy.de LUXEON: - LUMILED® LXK2-PW12-R00, LXK2-PW12-S00, LXK2-PW14-U00, LXK2-PW14-V00 LXK2-PM12-R00, LXK2-PM12-S00, LXK2-PM14-U00 LXK2-PE12-Q00, LXK2-PE12-R00, LXK2-PE12-S00, LXK2-PE14-T00, LXK2-PE14-U00 LXK2-PB12-K00, LXK2-PB12-L00, LXK2-PB12-M00, LXK2-PB14-N00, LXK2-PB14-P00, LXK2-PB14-Q00 LXK2-PR12-L00, LXK2-PR12-M00, LXK2-PR14-Q00, LXK2-PR14-R00 LXK2-PD12-Q00, LXK2-PD12-R00, LXK2-PD12-S00 LXK2-PH12-R00, LXK2-PH12-S00 LXK2-PL12-P00, LXK2-PL12-Q00, LXK2-PL12-R00 Source: www.luxeon.com KINGBRIGHT: KA-3528ASYC Source: www.kingbright.com
Q2 Q5 = transistor-small-signal:BSS84: P-CHANNEL MOS FET
Q3 = cube-parts:RESONATOR_EPSON_FC_145; FARNELL: 2101347
Q4 = transistor-small-signal:BSS123: N-CHANNEL MOS FET
R1-R32 = passives-7351:RESISTOR
SV2 SV3 = ti-tiva:FE26-2
TP1-TP25 = testpad:PTR1: TEST PIN
X1 X2 = CubeSat3:SHIELD; FARNELL: 2497719/2497718
X3 X4 = CubeSat3:LFTCXO070
X5-X18 = con-coax:BU-SMA-V: FEMALE SMA CONNECTOR Radiall distributor RS 112-3794; OC_FARNELL: unknown; OC_NEWARK: unknown
Y1 = SparkFun-Clocks:CRYSTAL-8MHZ: 8MHz Crystal Datasheet Example <http://www.futureelectronics.com/en/technologies/electromechanical/timing-devices/crystals/Pages/6008189-ABM3B-8.000MHZ-B2-T.aspx?IM=0> Frequency: 8MHz Frequency Tolerance: ±20ppm Load Capacitance: 18pF SparkFun Products: Pro Micro -3.3V/8MHz <https://www.sparkfun.com/products/12587> WAV Trigger <https://www.sparkfun.com/products/13660>; FARNELL: 2308726; PROD_ID: XTAL-09431